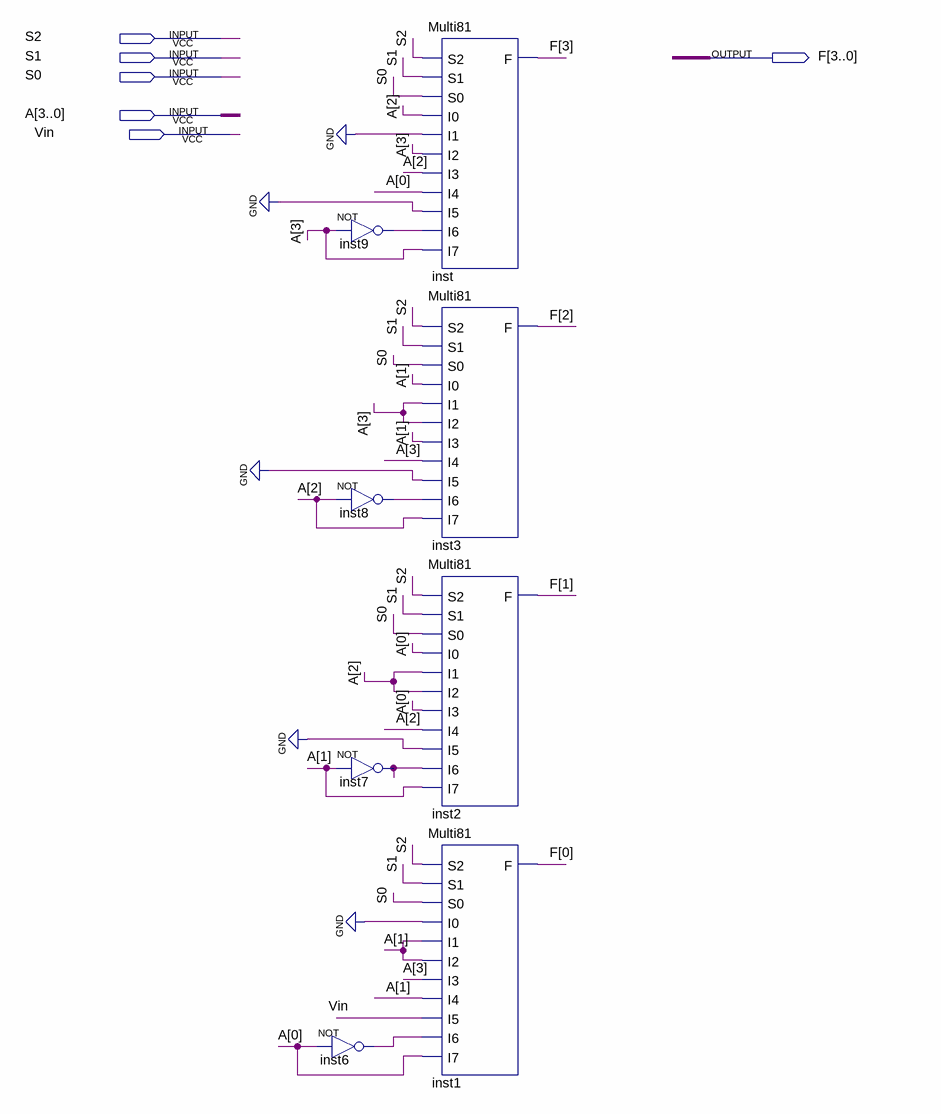
[diagram p0: schematic sheet]
// Quartus schematic ShiftingUnit.bdf as structural Verilog: 8 symbols, 6 pins
module ShiftingUnit (
  input  S2,
  input  S1,
  input  S0,
  input  [3:0] A,
  input  Vin,
  output [3:0] F
);

  wire inst6_out, inst7_out, inst8_out, inst9_out;

  not inst6 (inst6_out, A[0]);
  not inst9 (inst9_out, A[3]);
  not inst8 (inst8_out, A[2]);
  not inst7 (inst7_out, A[1]);
  Multi81 inst (
    .S2(S2), .S1(S1), .S0(S0), .I0(A[2]), .I1(1'b0), .I2(A[3]), .I3(A[2]), .I4(A[0]), .I5(1'b0),
    .I6(inst9_out), .I7(A[3]), .F(F[3]));
  Multi81 inst3 (
    .S2(S2), .S1(S1), .S0(S0), .I0(A[1]), .I1(A[3]), .I2(A[3]), .I3(A[1]), .I4(A[3]), .I5(1'b0),
    .I6(inst8_out), .I7(A[2]), .F(F[2]));
  Multi81 inst2 (
    .S2(S2), .S1(S1), .S0(S0), .I0(A[0]), .I1(A[2]), .I2(A[2]), .I3(A[0]), .I4(A[2]), .I5(1'b0),
    .I6(inst7_out), .I7(A[1]), .F(F[1]));
  Multi81 inst1 (
    .S2(S2), .S1(S1), .S0(S0), .I0(1'b0), .I1(A[1]), .I2(A[1]), .I3(A[3]), .I4(A[1]), .I5(Vin),
    .I6(inst6_out), .I7(A[0]), .F(F[0]));
endmodule
